# Altium schematic sheet stepper_motor.SchDoc
size A3
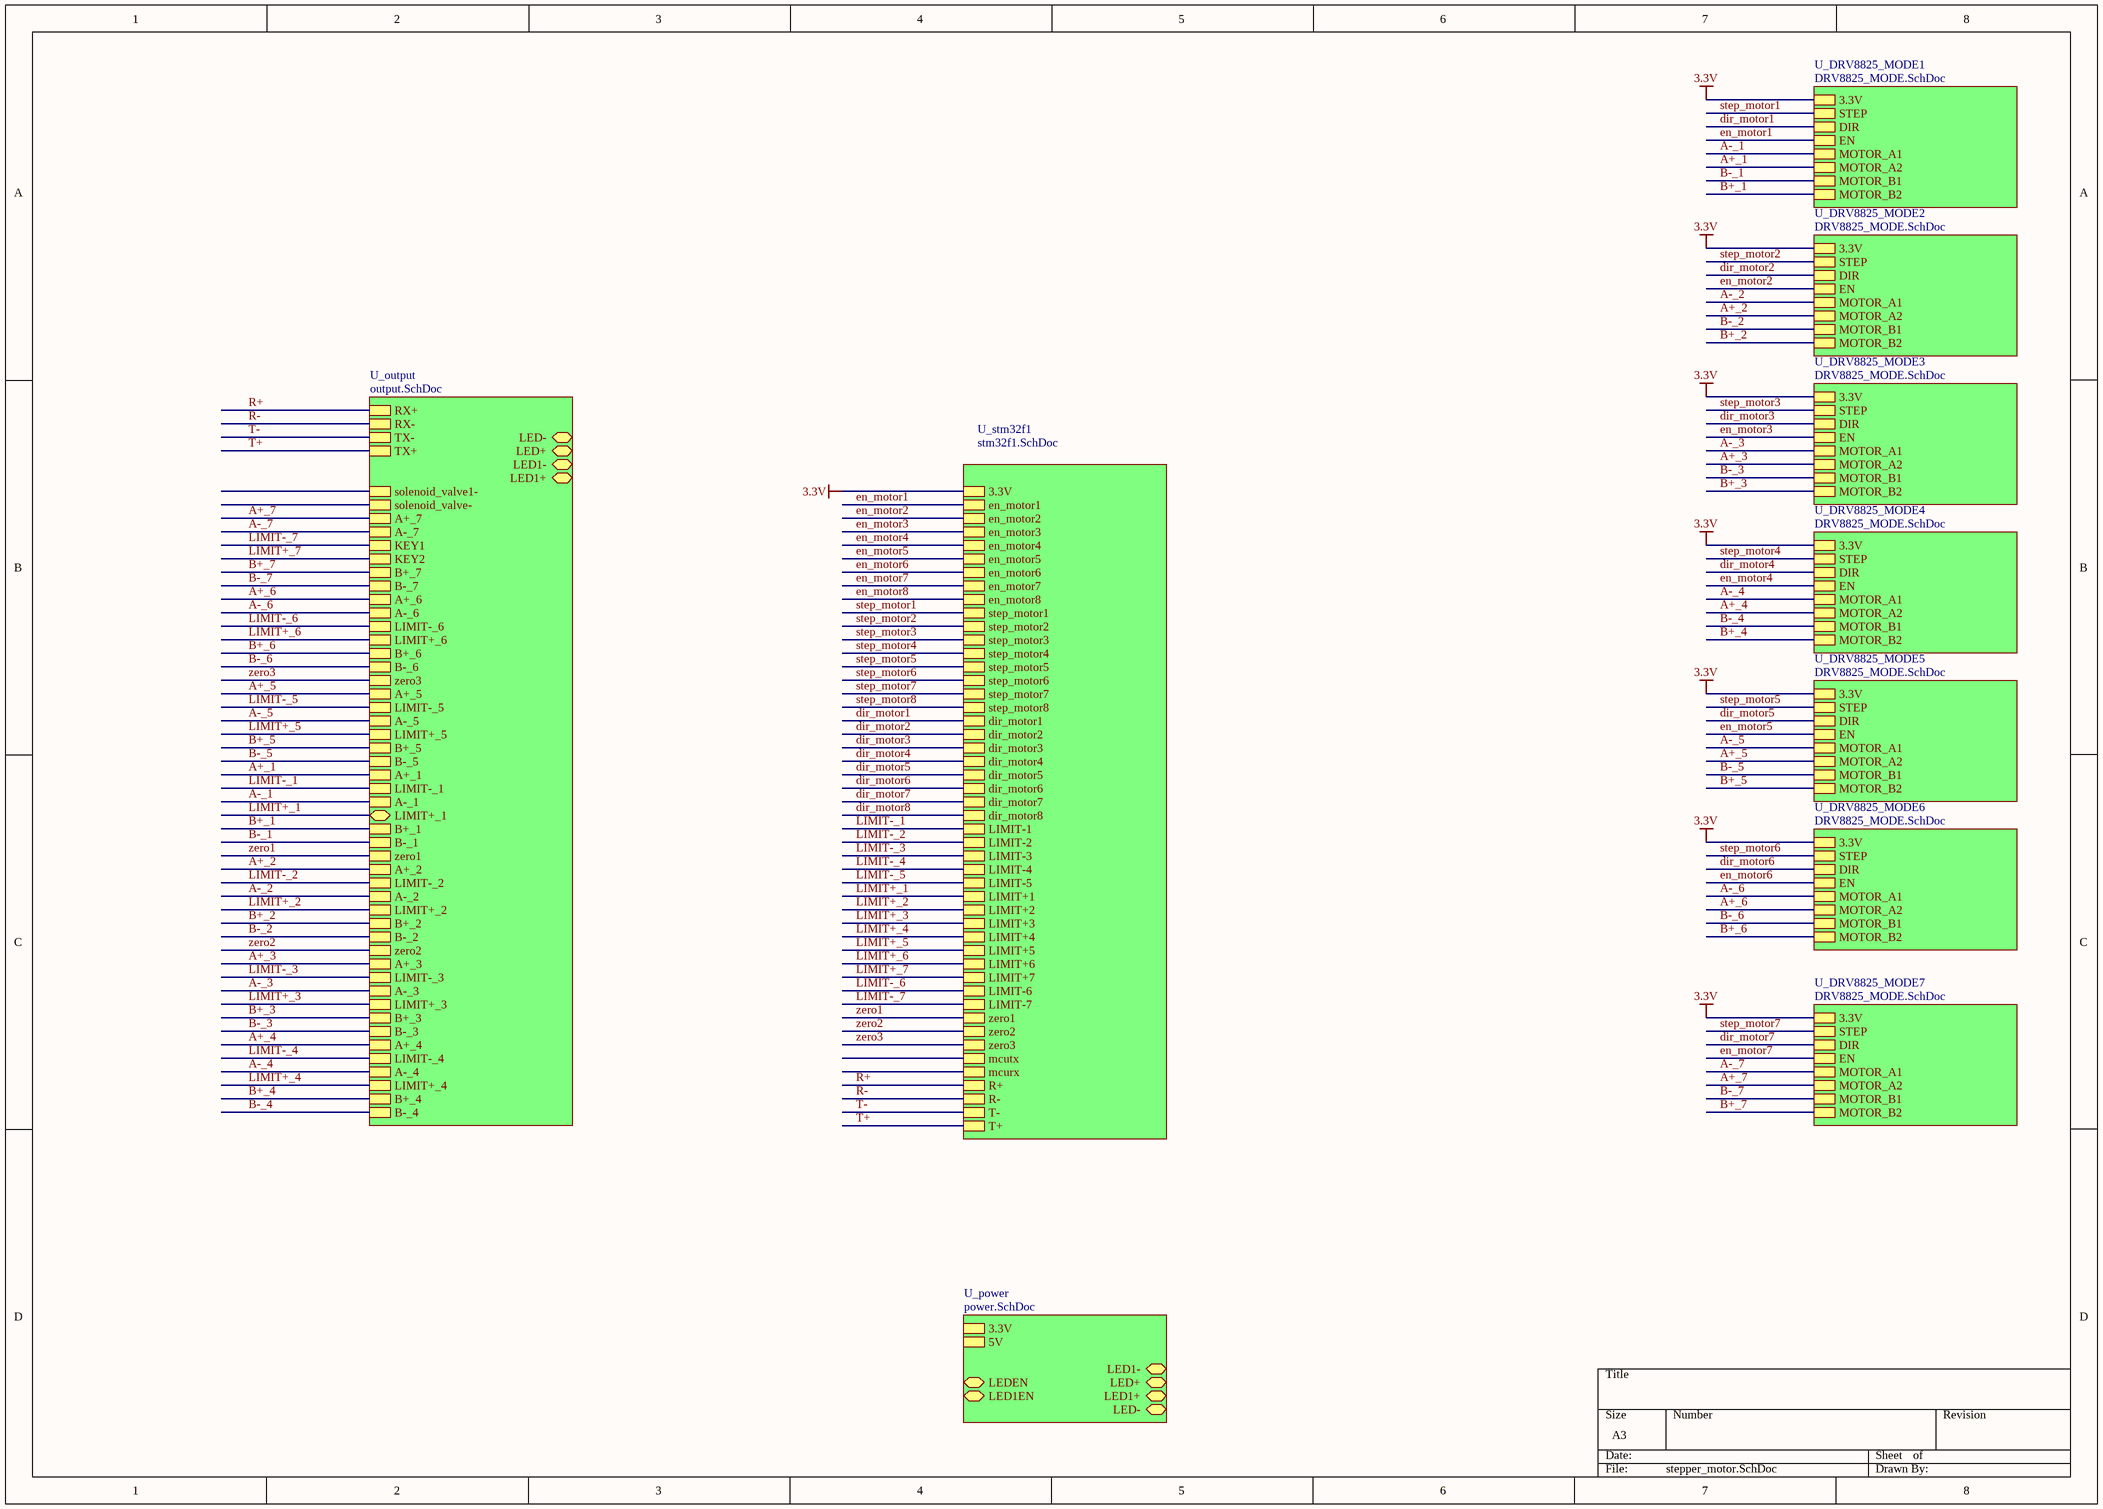
[diagram p0: stepper_motor.SchDoc]

## Sub-sheets
U_DRV8825_MODE1 = DRV8825_MODE.SchDoc: 3.3V, STEP, DIR, EN, MOTOR_A1, MOTOR_A2, MOTOR_B1, MOTOR_B2
U_DRV8825_MODE2 = DRV8825_MODE.SchDoc: 3.3V, STEP, DIR, EN, MOTOR_A1, MOTOR_A2, MOTOR_B1, MOTOR_B2
U_DRV8825_MODE3 = DRV8825_MODE.SchDoc: 3.3V, STEP, DIR, EN, MOTOR_A1, MOTOR_A2, MOTOR_B1, MOTOR_B2
U_DRV8825_MODE4 = DRV8825_MODE.SchDoc: 3.3V, STEP, DIR, EN, MOTOR_A1, MOTOR_A2, MOTOR_B1, MOTOR_B2
U_DRV8825_MODE5 = DRV8825_MODE.SchDoc: 3.3V, STEP, DIR, EN, MOTOR_A1, MOTOR_A2, MOTOR_B1, MOTOR_B2
U_DRV8825_MODE6 = DRV8825_MODE.SchDoc: 3.3V, STEP, DIR, EN, MOTOR_A1, MOTOR_A2, MOTOR_B1, MOTOR_B2
U_DRV8825_MODE7 = DRV8825_MODE.SchDoc: 3.3V, STEP, DIR, EN, MOTOR_A1, MOTOR_A2, MOTOR_B1, MOTOR_B2
U_output = output.SchDoc: RX+, RX-, TX-, TX+, solenoid_valve1-, solenoid_valve-, A+_7, A-_7, KEY1, KEY2, B+_7, B-_7, A+_6, A-_6, LIMIT-_6, LIMIT+_6, B+_6, B-_6, zero3, A+_5, LIMIT-_5, A-_5, LIMIT+_5, B+_5, B-_5, A+_1, LIMIT-_1, A-_1, B+_1, B-_1, zero1, A+_2, LIMIT-_2, A-_2, LIMIT+_2, B+_2, B-_2, zero2, A+_3, LIMIT-_3, A-_3, LIMIT+_3, B+_3, B-_3, A+_4, LIMIT-_4, A-_4, LIMIT+_4, B+_4, B-_4, LIMIT+_1, LED1+, LED+, LED-, LED1-
U_power = power.SchDoc: 3.3V, 5V, LED1-, LED+, LED1+, LED-, LEDEN, LED1EN
U_stm32f1 = stm32f1.SchDoc: 3.3V, en_motor1, en_motor2, en_motor3, en_motor4, en_motor5, en_motor6, en_motor7, en_motor8, step_motor1, step_motor2, step_motor3, step_motor4, step_motor5, step_motor6, step_motor7, step_motor8, dir_motor1, dir_motor2, dir_motor3, dir_motor4, dir_motor5, dir_motor6, dir_motor7, dir_motor8, LIMIT-1, LIMIT-2, LIMIT-3, LIMIT-4, LIMIT-5, LIMIT+1, LIMIT+2, LIMIT+3, LIMIT+4, LIMIT+5, LIMIT+6, LIMIT+7, LIMIT-6, LIMIT-7, zero1, zero2, zero3, mcutx, mcurx, R+, R-, T-, T+

## Nets
3.3V: sheet U_DRV8825_MODE1/3.3V, sheet U_stm32f1/3.3V, sheet U_DRV8825_MODE2/3.3V, sheet U_DRV8825_MODE3/3.3V, sheet U_DRV8825_MODE4/3.3V, sheet U_DRV8825_MODE5/3.3V, sheet U_DRV8825_MODE6/3.3V, sheet U_DRV8825_MODE7/3.3V
A+_1: sheet U_DRV8825_MODE1/MOTOR_A2, sheet U_output/A+_1
A+_2: sheet U_output/A+_2, sheet U_DRV8825_MODE2/MOTOR_A2
A+_3: sheet U_output/A+_3, sheet U_DRV8825_MODE3/MOTOR_A2
A+_4: sheet U_output/A+_4, sheet U_DRV8825_MODE4/MOTOR_A2
A+_5: sheet U_output/A+_5, sheet U_DRV8825_MODE5/MOTOR_A2
A+_6: sheet U_output/A+_6, sheet U_DRV8825_MODE6/MOTOR_A2
A+_7: sheet U_output/A+_7, sheet U_DRV8825_MODE7/MOTOR_A2
A-_1: sheet U_DRV8825_MODE1/MOTOR_A1, sheet U_output/A-_1
A-_2: sheet U_output/A-_2, sheet U_DRV8825_MODE2/MOTOR_A1
A-_3: sheet U_output/A-_3, sheet U_DRV8825_MODE3/MOTOR_A1
A-_4: sheet U_output/A-_4, sheet U_DRV8825_MODE4/MOTOR_A1
A-_5: sheet U_output/A-_5, sheet U_DRV8825_MODE5/MOTOR_A1
A-_6: sheet U_output/A-_6, sheet U_DRV8825_MODE6/MOTOR_A1
A-_7: sheet U_output/A-_7, sheet U_DRV8825_MODE7/MOTOR_A1
B+_1: sheet U_DRV8825_MODE1/MOTOR_B2, sheet U_output/B+_1
B+_2: sheet U_output/B+_2, sheet U_DRV8825_MODE2/MOTOR_B2
B+_3: sheet U_output/B+_3, sheet U_DRV8825_MODE3/MOTOR_B2
B+_4: sheet U_output/B+_4, sheet U_DRV8825_MODE4/MOTOR_B2
B+_5: sheet U_output/B+_5, sheet U_DRV8825_MODE5/MOTOR_B2
B+_6: sheet U_output/B+_6, sheet U_DRV8825_MODE6/MOTOR_B2
B+_7: sheet U_output/B+_7, sheet U_DRV8825_MODE7/MOTOR_B2
B-_1: sheet U_DRV8825_MODE1/MOTOR_B1, sheet U_output/B-_1
B-_2: sheet U_output/B-_2, sheet U_DRV8825_MODE2/MOTOR_B1
B-_3: sheet U_output/B-_3, sheet U_DRV8825_MODE3/MOTOR_B1
B-_4: sheet U_output/B-_4, sheet U_DRV8825_MODE4/MOTOR_B1
B-_5: sheet U_output/B-_5, sheet U_DRV8825_MODE5/MOTOR_B1
B-_6: sheet U_output/B-_6, sheet U_DRV8825_MODE6/MOTOR_B1
B-_7: sheet U_output/B-_7, sheet U_DRV8825_MODE7/MOTOR_B1
dir_motor1: sheet U_DRV8825_MODE1/DIR, sheet U_stm32f1/dir_motor1
dir_motor2: sheet U_stm32f1/dir_motor2, sheet U_DRV8825_MODE2/DIR
dir_motor3: sheet U_stm32f1/dir_motor3, sheet U_DRV8825_MODE3/DIR
dir_motor4: sheet U_stm32f1/dir_motor4, sheet U_DRV8825_MODE4/DIR
dir_motor5: sheet U_stm32f1/dir_motor5, sheet U_DRV8825_MODE5/DIR
dir_motor6: sheet U_stm32f1/dir_motor6, sheet U_DRV8825_MODE6/DIR
dir_motor7: sheet U_stm32f1/dir_motor7, sheet U_DRV8825_MODE7/DIR
dir_motor8: sheet U_stm32f1/dir_motor8
en_motor1: sheet U_DRV8825_MODE1/EN, sheet U_stm32f1/en_motor1
en_motor2: sheet U_stm32f1/en_motor2, sheet U_DRV8825_MODE2/EN
en_motor3: sheet U_stm32f1/en_motor3, sheet U_DRV8825_MODE3/EN
en_motor4: sheet U_stm32f1/en_motor4, sheet U_DRV8825_MODE4/EN
en_motor5: sheet U_stm32f1/en_motor5, sheet U_DRV8825_MODE5/EN
en_motor6: sheet U_stm32f1/en_motor6, sheet U_DRV8825_MODE6/EN
en_motor7: sheet U_stm32f1/en_motor7, sheet U_DRV8825_MODE7/EN
en_motor8: sheet U_stm32f1/en_motor8
LIMIT+_1: sheet U_stm32f1/LIMIT+1, sheet U_output/LIMIT+_1
LIMIT+_2: sheet U_stm32f1/LIMIT+2, sheet U_output/LIMIT+_2
LIMIT+_3: sheet U_stm32f1/LIMIT+3, sheet U_output/LIMIT+_3
LIMIT+_4: sheet U_stm32f1/LIMIT+4, sheet U_output/LIMIT+_4
LIMIT+_5: sheet U_stm32f1/LIMIT+5, sheet U_output/LIMIT+_5
LIMIT+_6: sheet U_stm32f1/LIMIT+6, sheet U_output/LIMIT+_6
LIMIT+_7: sheet U_stm32f1/LIMIT+7, sheet U_output/KEY2
LIMIT-_1: sheet U_stm32f1/LIMIT-1, sheet U_output/LIMIT-_1
LIMIT-_2: sheet U_stm32f1/LIMIT-2, sheet U_output/LIMIT-_2
LIMIT-_3: sheet U_stm32f1/LIMIT-3, sheet U_output/LIMIT-_3
LIMIT-_4: sheet U_stm32f1/LIMIT-4, sheet U_output/LIMIT-_4
LIMIT-_5: sheet U_stm32f1/LIMIT-5, sheet U_output/LIMIT-_5
LIMIT-_6: sheet U_stm32f1/LIMIT-6, sheet U_output/LIMIT-_6
LIMIT-_7: sheet U_stm32f1/LIMIT-7, sheet U_output/KEY1
R+: sheet U_stm32f1/R+, sheet U_output/RX+
R-: sheet U_stm32f1/R-, sheet U_output/RX-
step_motor1: sheet U_DRV8825_MODE1/STEP, sheet U_stm32f1/step_motor1
step_motor2: sheet U_stm32f1/step_motor2, sheet U_DRV8825_MODE2/STEP
step_motor3: sheet U_stm32f1/step_motor3, sheet U_DRV8825_MODE3/STEP
step_motor4: sheet U_stm32f1/step_motor4, sheet U_DRV8825_MODE4/STEP
step_motor5: sheet U_stm32f1/step_motor5, sheet U_DRV8825_MODE5/STEP
step_motor6: sheet U_stm32f1/step_motor6, sheet U_DRV8825_MODE6/STEP
step_motor7: sheet U_stm32f1/step_motor7, sheet U_DRV8825_MODE7/STEP
step_motor8: sheet U_stm32f1/step_motor8
T+: sheet U_stm32f1/T+, sheet U_output/TX+
T-: sheet U_stm32f1/T-, sheet U_output/TX-
zero1: sheet U_stm32f1/zero1, sheet U_output/zero1
zero2: sheet U_stm32f1/zero2, sheet U_output/zero2
zero3: sheet U_stm32f1/zero3, sheet U_output/zero3